# Altium project if-amp.PrjPcb
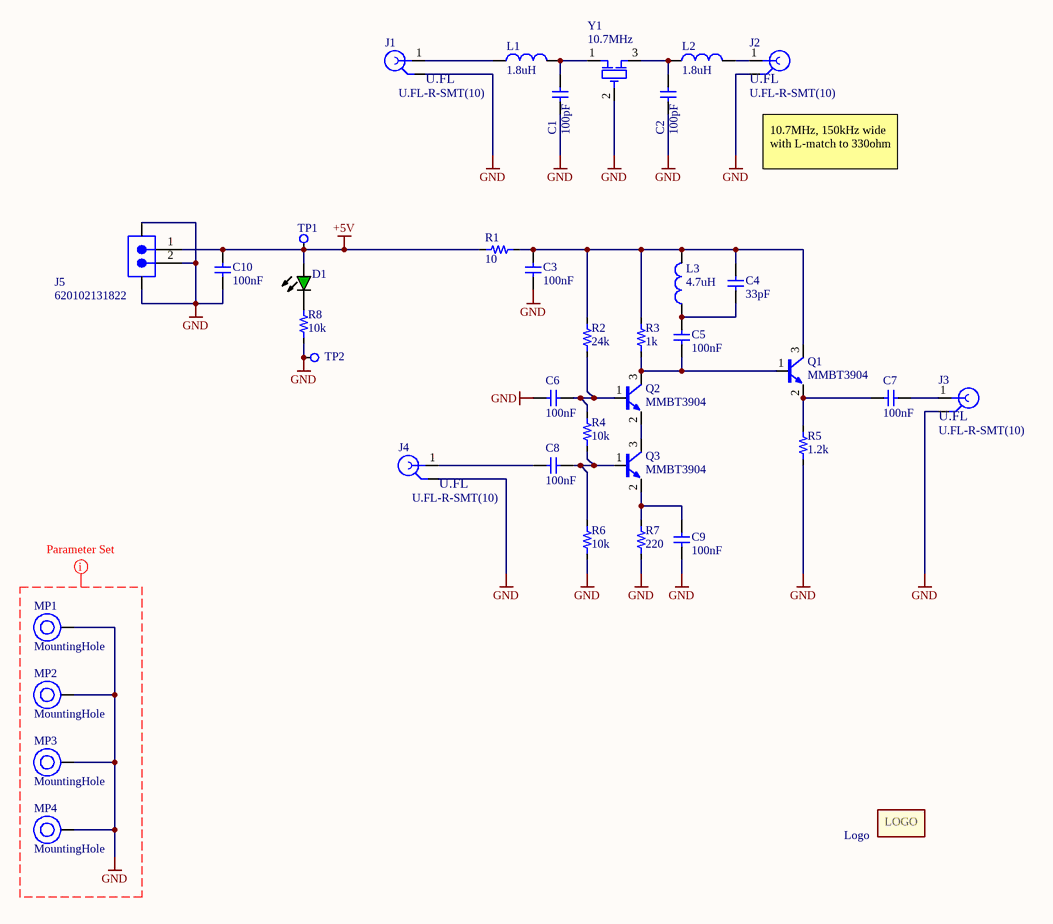
[diagram p0: main.SchDoc]
assembly_revision: 0; board_name: IF-AMP; board_revision: 1.0; Project_link: https://github.com/LieBtrau/MegawattKS_Radio_Design_101
1 sheet, 38 parts. Net scope: global (net labels, ports and power ports of the same name join across sheets).
Board file: if-amp.PcbDoc

## Sheet main.SchDoc: IF-filter and IF-amplifier
size A4; Engineer: CT; SheetNumber: 1; SheetTotal: 1

### Parts
C1  value 100pF  [0603-C-N]  (hidden comment: Capacitor 100pF +/-5% 50V NP0 0603)
C2  value 100pF  [0603-C-N]  (hidden comment: Capacitor 100pF +/-5% 50V NP0 0603)
C3  value 100nF  [0603-C-N]  (hidden comment: Capacitor 100nF +/-10% 50V X7R 0603)
C4  value 33pF  [0603-C-N]  (hidden comment: Capacitor 33pF +/-5% 50V NP0 0603)
C5  value 100nF  [0603-C-N]  (hidden comment: Capacitor 100nF +/-10% 50V X7R 0603)
C6  value 100nF  [0603-C-N]  (hidden comment: Capacitor 100nF +/-10% 50V X7R 0603)
C7  value 100nF  [0603-C-N]  (hidden comment: Capacitor 100nF +/-10% 50V X7R 0603)
C8  value 100nF  [0603-C-N]  (hidden comment: Capacitor 100nF +/-10% 50V X7R 0603)
C9  value 100nF  [0603-C-N]  (hidden comment: Capacitor 100nF +/-10% 50V X7R 0603)
C10  value 100nF  [0603-C-N]  (hidden comment: Capacitor 100nF +/-10% 50V X7R 0603)
D1  150060GS84000  [WL-SMCW_0603_150060xx8x000]  (value not drawn)
GR1  Logo  [LOGO_9x6mm]  (no BOM)
J1  U.FL-R-SMT(10)  [HRS-U.FL-R-SMT_V]
J2  U.FL-R-SMT(10)  [HRS-U.FL-R-SMT_V]
J3  U.FL-R-SMT(10)  [HRS-U.FL-R-SMT_V]
J4  U.FL-R-SMT(10)  [HRS-U.FL-R-SMT_V]
J5  620102131822  [620102131822]
L1  value 1.8uH  [WE-KI_1008]  (hidden comment: AISC-1008F-1R8G-T)
L2  value 1.8uH  [WE-KI_1008]  (hidden comment: AISC-1008F-1R8G-T)
L3  value 4.7uH  [WE-KI_1008]  (hidden comment: AISC-1008F-4R7G-T)
MP1  MountingHole  [PTH-M3D6.5_VIA-RING]  (no BOM)
MP2  MountingHole  [PTH-M3D6.5_VIA-RING]  (no BOM)
MP3  MountingHole  [PTH-M3D6.5_VIA-RING]  (no BOM)
MP4  MountingHole  [PTH-M3D6.5_VIA-RING]  (no BOM)
Q1  MMBT3904  [SOT-23-3-N]
Q2  MMBT3904  [SOT-23-3-N]
Q3  MMBT3904  [SOT-23-3-N]
R1  value 10  [0603-R-N]  (hidden comment: Resistor 10R +/-1% 50V 0603)
R2  value 24k  [0603-R-N]  (hidden comment: Resistor 24k +/-1% 50V 0603)
R3  value 1k  [0603-R-N]  (hidden comment: Resistor 1k +/-1% 50V 0603)
R4  value 10k  [0603-R-N]  (hidden comment: Resistor 10k +/-1% 50V 0603)
R5  value 1.2k  [0603-R-N]  (hidden comment: Resistor 1.2k +/-1% 50V 0603)
R6  value 10k  [0603-R-N]  (hidden comment: Resistor 10k +/-1% 50V 0603)
R7  value 220  [0603-R-N]  (hidden comment: Resistor 220R +/-1% 0.1W 0603)
R8  value 10k  [0603-R-N]  (hidden comment: Resistor 10k +/-1% 50V 0603)
TP1  Testpad with multiple sizes  [TP_1.5mm_0.3mmHole]  (value not drawn)  (no BOM)
TP2  Testpad with multiple sizes  [TP_1.5mm_0.3mmHole]  (value not drawn)  (no BOM)
Y1  Frequency: 10.7MHz  [FP-SFECV10M7JA00-R0-MFG]  (hidden comment: SFECV10M7JA00-R0)

### Nets
+5V: C10.2 D1.2(A) J5.1 R1.2 TP1.1(Pad)
GND: C1.1 C2.1 C3.1 C6.2 C9.1 C10.1 J1.2(GND) J2.2(GND) J3.2(GND) J4.2(GND) J5.2 J5.MP1 J5.MP2 MP1.1(H1) MP2.1(H1) MP3.1(H1) MP4.1(H1) R5.1 R6.1 R7.1 R8.1 TP2.1(Pad) Y1.2
NetC1_2: C1.2 L1.2 Y1.1
NetC2_2: C2.2 L2.1 Y1.3
NetC3_2: C3.2 C4.2 L3.2 Q1.3(C) R1.1 R2.2 R3.2
NetC4_1: C4.1 C5.1 L3.1
NetC5_2: C5.2 Q1.1(B) Q2.3(C) R3.1
NetC6_1: C6.1 Q2.1(B) R2.1 R4.2
NetC7_1: C7.1 J3.1(SIG)
NetC7_2: C7.2 Q1.2(E) R5.2
NetC8_1: C8.1 Q3.1(B) R4.1 R6.2
NetC8_2: C8.2 J4.1(SIG)
NetC9_2: C9.2 Q3.2(E) R7.2
NetD1_1: D1.1(K) R8.2
NetJ1_1: J1.1(SIG) L1.1
NetJ2_1: J2.1(SIG) L2.2
NetQ2_2: Q2.2(E) Q3.3(C)

### Layout directives
CompClassName: NonSolder: GND

### Notes on the sheet
- (near J2) 10.7MHz, 150kHz wide
  with L-match to 330ohm
- Title:
- Sheet
- Size:
- Name:
- Revision:
- A4
- Date:
- of
- Project
- Variant
- Project:
- Link:
- Description:
- Designer
- (in symbol Logo) LOGO

### Library data of the parts
C1 C2 = CMP-072-000128-18: WCAP-CSGP Multilayer Ceramic Chip Capacitor, General Purpose, size 0603, NP0, 100pF, 50VDC; Page Part #: CCQJ101; Technical Reference: NP00603101J050DFCT10000; Tolerance: 5%; Insulation Resistance: 10GO; Capacitor Type: MLCC; Q Factor: 1000; Packaging: Tape and Reel; ComponentLink1Description: Website Link; Design Item ID: 885012006057; Match Code: WCAP-CSGP; ComponentLink2URL: https://www.we-online.com/redexpert/spec/885012006057?ad; Dielectric: NP0; Min Operating Temperature: -55°C; Max Operating Temperature: 125°C; Mounting Technology: SMT; Case/Package: 0603; ComponentLink1URL: https://www.we-online.com/redexpert/article/885012006057?ad; Source: WCAP-CSGP.SchLib; Voltage Rating: 50V; Width: 0.8mm; Pins: 2; JLCPCB Part #: C14858; ComponentLink2Description: Datasheet Link; Usage: General Purpose; Length: 1.6mm; Height: 0.8mm; JLCPCB Basic part: Yes
C3 C5-C10 = CMP-001-00017-25: Capacitor MLCC, General Purpose, size 0603, X7R, 100nF, +/-10%, 50V; Page Part #: CCQK104; Tolerance: 10%; Min Operating Temperature: -55°C; RoHS Compliant: True; Length: 1.6mm; Max Operating Temperature: 125°C; JLCPCB Part #: C14663; Voltage Rating: 50V; Width: 0.8mm; Dielectric: X7R; Case/Package: 0603; Height: 0.8mm; Mounting Technology: SMT; Pins: 2; Capacitor Type: MLCC; Usage: General Purpose; JLCPCB Basic part: Yes
C4 = CMP-072-000125-16: WCAP-CSGP Multilayer Ceramic Chip Capacitor, General Purpose, size 0603, NP0, 33pF, 50VDC; Q Factor: 1000; Technical Reference: NP00603330J050DFCT10000; Insulation Resistance: 10GO; Capacitor Type: MLCC; Tolerance: 5%; Usage: General Purpose; Case/Package: 0603; Height: 0.8mm; ComponentLink2URL: https://www.we-online.com/redexpert/spec/885012006054?ad; Dielectric: NP0; Width: 0.8mm; Mounting Technology: SMT; Voltage Rating: 50V; Length: 1.6mm; ComponentLink2Description: Datasheet Link; ComponentLink1Description: Website Link; Design Item ID: 885012006054; Pins: 2; Max Operating Temperature: 125°C; Min Operating Temperature: -55°C; Packaging: Tape and Reel; Source: WCAP-CSGP.SchLib; Match Code: WCAP-CSGP; ComponentLink1URL: https://www.we-online.com/redexpert/article/885012006054?ad; JLCPCB Basic Part: Yes; JLCPCB Part #: C1663
D1 = CMP-002-001076-16: WL-SMCW Mono-color Chip LED Waterclear, size 0603, Green, 3.3V, 40°; Manufacturer: Wurth Elektronik; Page Part #: MOVPA-0270A; Chip Technology: InGaN; Case/Size Code: 0603; Luminous Intensity: 3000mcd; Peak Wavelength: 520nm; Dominant Wavelength: 525nm; Mount: Surface Mount; Design Item ID: 150060GS84000; Category: Signal LEDs; Component Type: Standard; Emitting Color: Green; Viewing Angle: 40°; Height: 0.95mm; Width: 0.8mm; Length: 1.6mm; JLCPCB Part #: C7429914; Packaging: Tape and Reel; Match Code: WL-SMCW; ComponentLink2Description: Datasheet Link; Forward Voltage: 3.3V; ComponentLink1Description: Website Link; ComponentLink2URL: https://www.we-online.com/redexpert/spec/150060GS84000?ad; Source: WL-SMCW.SchLib; Operating Temperature Max: 85°C; Manufacturer Part Number: 150060GS84000; Pin Count: 2; Operating Temperature Min: -40°C; ComponentLink1URL: https://www.we-online.com/redexpert/article/150060GS84000?ad
J1-J4 = CMP-002-00035-12: Ultra Small Surface Mount Coaxial Connector, 50 Ohm, -40 to 90 degC, 3-Pin SMD, RoHS, Tape and Reel; pin to pad: 1>3 2>1+2; Manufacturer: Hirose Electric; Connector Type: RF&Coax; Impedance: 50Ohm; Value: U.FL; Case/Package: U.FL-R-SMT; Package Quantity: 2500; Packaging: TapeandReel; RoHS Compliant: True; Contact Material: Brass; Contact Plating: Gold; Min Operating Temperature: -40°C; JLCPCB Part #: C88373; Package Reference: U.FL-R-SMT; Datasheet Version: Aug-16; Manufacturer URL: https://www.hirose.com; Max Operating Temperature: 90°C; Fastening Type: Snap; Package Description: 3-Pin Surface Mount Device, Body 2.6 x 2.6 mm; Resistance: 50Ohm; Mounting Technology: SM; Datasheet URL: https://www.hirose.com/product/en/download_file/key_name/U.FL/category/Catalog/doc_file_id/31697/?file_category_id=4&item_id=15&is_series=1
J5 = CMP-047-000040-15: WR-WTB SMT Male Horizontal Shrouded Header, pitch 2mm, 2p; Page Part #: K620102131822; Pin Number: 2; Rated Current: 2A; Contact Resistance: 20mOhm; Value: JST-PH; Withstanding Voltage: 800VAC; Working Voltage: 100VAC; Source: WR-WTB_2.00mm.SchLib; Operating Temperature: -25 to +85degC; JLCPCB Part #: C295747; Pin Count: 2; Pitch: 2mm; Part Number: 620102131822; Component Type: Standard; Packaging: Tape and Reel; Type: Horizontal; Publisher: Wurth Elektronik; Gender: Male; ComponentLink2Description: Datasheet; ComponentLink1Description: Manufacturer; Mounting Technology: SMT; ComponentLink1URL: http://www.we-online.de; ComponentLink2URL: https://www.we-online.com/catalog/datasheet/620102131822.pdf; Published Date: January 2020; Design Item ID: 620102131822
L1 L2 = CMP-006-00043-2: Ind Chip Unshielded Wirewound 1.8uH 2% 7.9MHz 39Q-Factor Ferrite 600mA 1008 T/R; Max DC Current: 1A; DC Resistance (DCR): 840mR; Self Resonant Frequency: 170MHz; Q Factor: 39; Tolerance: 2%; Max Operating Temperature: 85°C; Case Code (Imperial): 1008; Termination: SMD/SMT; Height: 2.29mm; Min Operating Temperature: -40°C; Test Frequency: 7.9MHz; Current Rating: 600mA; Case Code (Metric): 2520; Length: 0.114inch; Package Quantity: 1; Packaging: Tape and Reel; Width: 2.79mm; Shielding: Unshielded; Core Material: Ferrite; Mounting Technology: Surface Mount; Series: AISC-1008F; Case/Package: 1008; JLCPCB Basic Part: No; JLCPCB Part #: C524646
L3 = CMP-006-00044-2: Inductor RF Wirewound 4.7uH 2% 7.9MHz 31Q-Factor Ferrite 0.4A 1.68Ohm DCR 1008 T/R; Max DC Current: 1A; Q Factor: 31; Self Resonant Frequency: 60MHz; Current Rating: 400mA; Shielding: Unshielded; DC Resistance (DCR): 1.68R; Tolerance: 2%; Core Material: Ferrite; Termination: SMD/SMT; Test Frequency: 7.9MHz; Series: AISC-1008F; Case/Package: 1008; Packaging: Tape and Reel; Max Operating Temperature: 125°C; Length: 0.114inch; Case Code (Metric): 2520; Width: 2.79mm; Case Code (Imperial): 1008; Min Operating Temperature: -40°C; Mounting Technology: Surface Mount; Height: 0.09inch; Package Quantity: 1; JLCPCB Basic Part: No; JLCPCB Part #: C108275
MP1-MP4 = CMP-00028-00004-15: Mounting hole.  Add this so that mounting holes placed in your design don't automagically disappear when you import changes from the schematic.; Pins: 1
Q1-Q3 = CMP-014-00026-4: NPN General Purpose Amplifier, 40 V, 0.2 A, -55 to 150 degC, 3-Pin SOT23, RoHS, Tape and Reel; Manufacturer: Fairchild Semiconductor; Elements: 1; Frequency: 300MHz; hFE Min: 100; Vce Max: 300mV; Package Version: Rev. 12, 03/2016; Power: 625mW; Packaging: TapeandReel; Datasheet Version: Rev. 1.1.0, 10/2014; RoHS Compliant: True; Package Quantity: 3000; Pins: 3; Case/Package: TO-236-3; Package Reference: SOT23-3; Mounting Technology: SM; Package URL: http://www.fairchildsemi.com/dwg/MA/MA03D.pdf; Min Operating Temperature: -55°C; Datasheet URL: https://www.fairchildsemi.com/datasheets/MM/MMBT3904.pdf; Manufacturer URL: https://www.fairchildsemi.com/; Max Operating Temperature: 150°C; JLCPCB Part #: C20526; Package Description: 3-Pin Small Outline Transistor, Body 2.92 x 1.325 mm, Pitch 0.95 mm
R1 = CMP-009-00230-19: Chip Resistor, Thick Film, General Purpose, 0603, 100mW, 50V, 10 Ohm, +/-1%; Page Part #: ROQF1009; Tolerance: 1%; Elements: 1; Temperature Coefficient: 200ppm/°C; Pins: 2; Max Operating Temperature: 155°C; Mounting Technology: SMT; RoHS Compliant: Yes; JLCPCB Part #: C22859; Voltage Rating: 50V; Case/Package: 0603; Resistor Type: Thick Film; Min Operating Temperature: -55°C; Power Rating: 100mW; Usage: General Purpose
R2 = CMP-009-00194-22: Chip Resistor, Thick Film, General Purpose, 0603, 100mW, 50V, 24 kOhm, +/-1%; Temperature Coefficient: 100ppm/°C; Elements: 1; Tolerance: 1%; Usage: General Purpose; Resistor Type: Thick Film; Power Rating: 100mW; Pins: 2; Max Operating Temperature: 155°C; Case/Package: 0603; Min Operating Temperature: -55°C; Voltage Rating: 50V; Mounting Technology: SMT; JLCPCB Basic Part: Yes; JLCPCB Part #: C23352
R3 = CMP-009-00014-29: Chip Resistor, Thick Film, General Purpose, 0603, 100mW, 50V, 1 kOhm, +/-1%; FLIR Part #: YRES1K-1; Page Part #: ROQF1001; Tolerance: 1%; Elements: 1; JLCPCB Part #: C21190; Pins: 2; Resistor Type: Thick Film; RoHS Compliant: Yes; Case/Package: 0603; Min Operating Temperature: -55°C; Power Rating: 100mW; Mounting Technology: SMT; Usage: General Purpose; Max Operating Temperature: 155°C; Voltage Rating: 50V
R4 R6 R8 = CMP-009-00017-29: Chip Resistor, Thick Film, General Purpose, 0603, 100mW, 50V, 10 kOhm, +/-1%; FLIR Part #: YRES10K-1; Page Part #: ROQF1002; Elements: 1; Tolerance: 1%; Pins: 2; Resistor Type: Thick Film; Voltage Rating: 50V; Power Rating: 100mW; Mounting Technology: SMT; Min Operating Temperature: -55°C; Case/Package: 0603; RoHS Compliant: Yes; Usage: General Purpose; JLCPCB Part #: C25804; Max Operating Temperature: 155°C; JLCPCB Basic part: Yes
R5 = CMP-009-00244-17: Chip Resistor, Thick Film, General Purpose, 0603, 100mW, 50V, 1.2 kOhm, +/-1%; Tolerance: 1%; Elements: 1; Usage: General Purpose; Min Operating Temperature: -55°C; Resistor Type: Thick Film; Mounting Technology: SMT; Power Rating: 100mW; Voltage Rating: 50V; JLCPCB Part #: C22765; Pins: 2; Case/Package: 0603; RoHS Compliant: Yes; Max Operating Temperature: 155°C
R7 = CMP-009-00390-2: Res Thick Film 0603 220 Ohm 1% 0.1W(1/10W) ±100ppm/C Pad SMD T/R Automotive AEC-Q200; Page Part #: ROQF2200; Power Rating: 100mW; Voltage Rating: 75V; Temperature Coefficient: 100ppm/°C; Max Operating Temperature: 155°C; Packaging: Tape and Reel; Length: 0.061inch; Case/Package: 0603; Case Code (Imperial): 0603; Lead Free: Lead Free; Max Power Dissipation: 100mW; Tolerance: 1%; Min Operating Temperature: -55°C; Features: Automotive AEC-Q200; Contact Plating: Tin,Matte; Mounting Technology: Surface Mount; Height: 0.022inch; Radiation Hardening: No; Number of Terminations: 2; Width: 0.031inch; JLCPCB Part #: C22962; Case Code (Metric): 1608; Series: RMCF; RoHS Compliant: Yes
TP1 TP2 = CMP-027-000000-17: Testpad land; Design Item ID: Testpad; Component Type: Standard; Pin Count: 1
Y1 = CMP-003-00038-1: SFECV Series 10.7 MHz 2 Element 150 kHz Bw 330 Ohm Surface Mount Ceramic Filter; Insertion Loss: 5.5dB; Bandwidth: 150kHz; Impedance: 330R; Filter Type: FM; Radiation Hardening: No; Case Code (Metric): 6915; Width: 0.059inch; Pins: 3; Package Quantity: 1; Max Operating Temperature: 80°C; Min Operating Temperature: -20°C; Lead Free: Lead Free; Series: CERAFIL®, SFECV; Length: 0.272inch; Height: 0.067inch; Mounting Technology: Surface Mount; Packaging: Tape and Reel; Case/Package: SMD/SMT; RoHS Compliant: Yes; Termination: SMD/SMT; Case Code (Imperial): 2706

## Assembly variants
A: all parts fitted